# EAGLE design LocoShield (EAGLE 7.7.0)
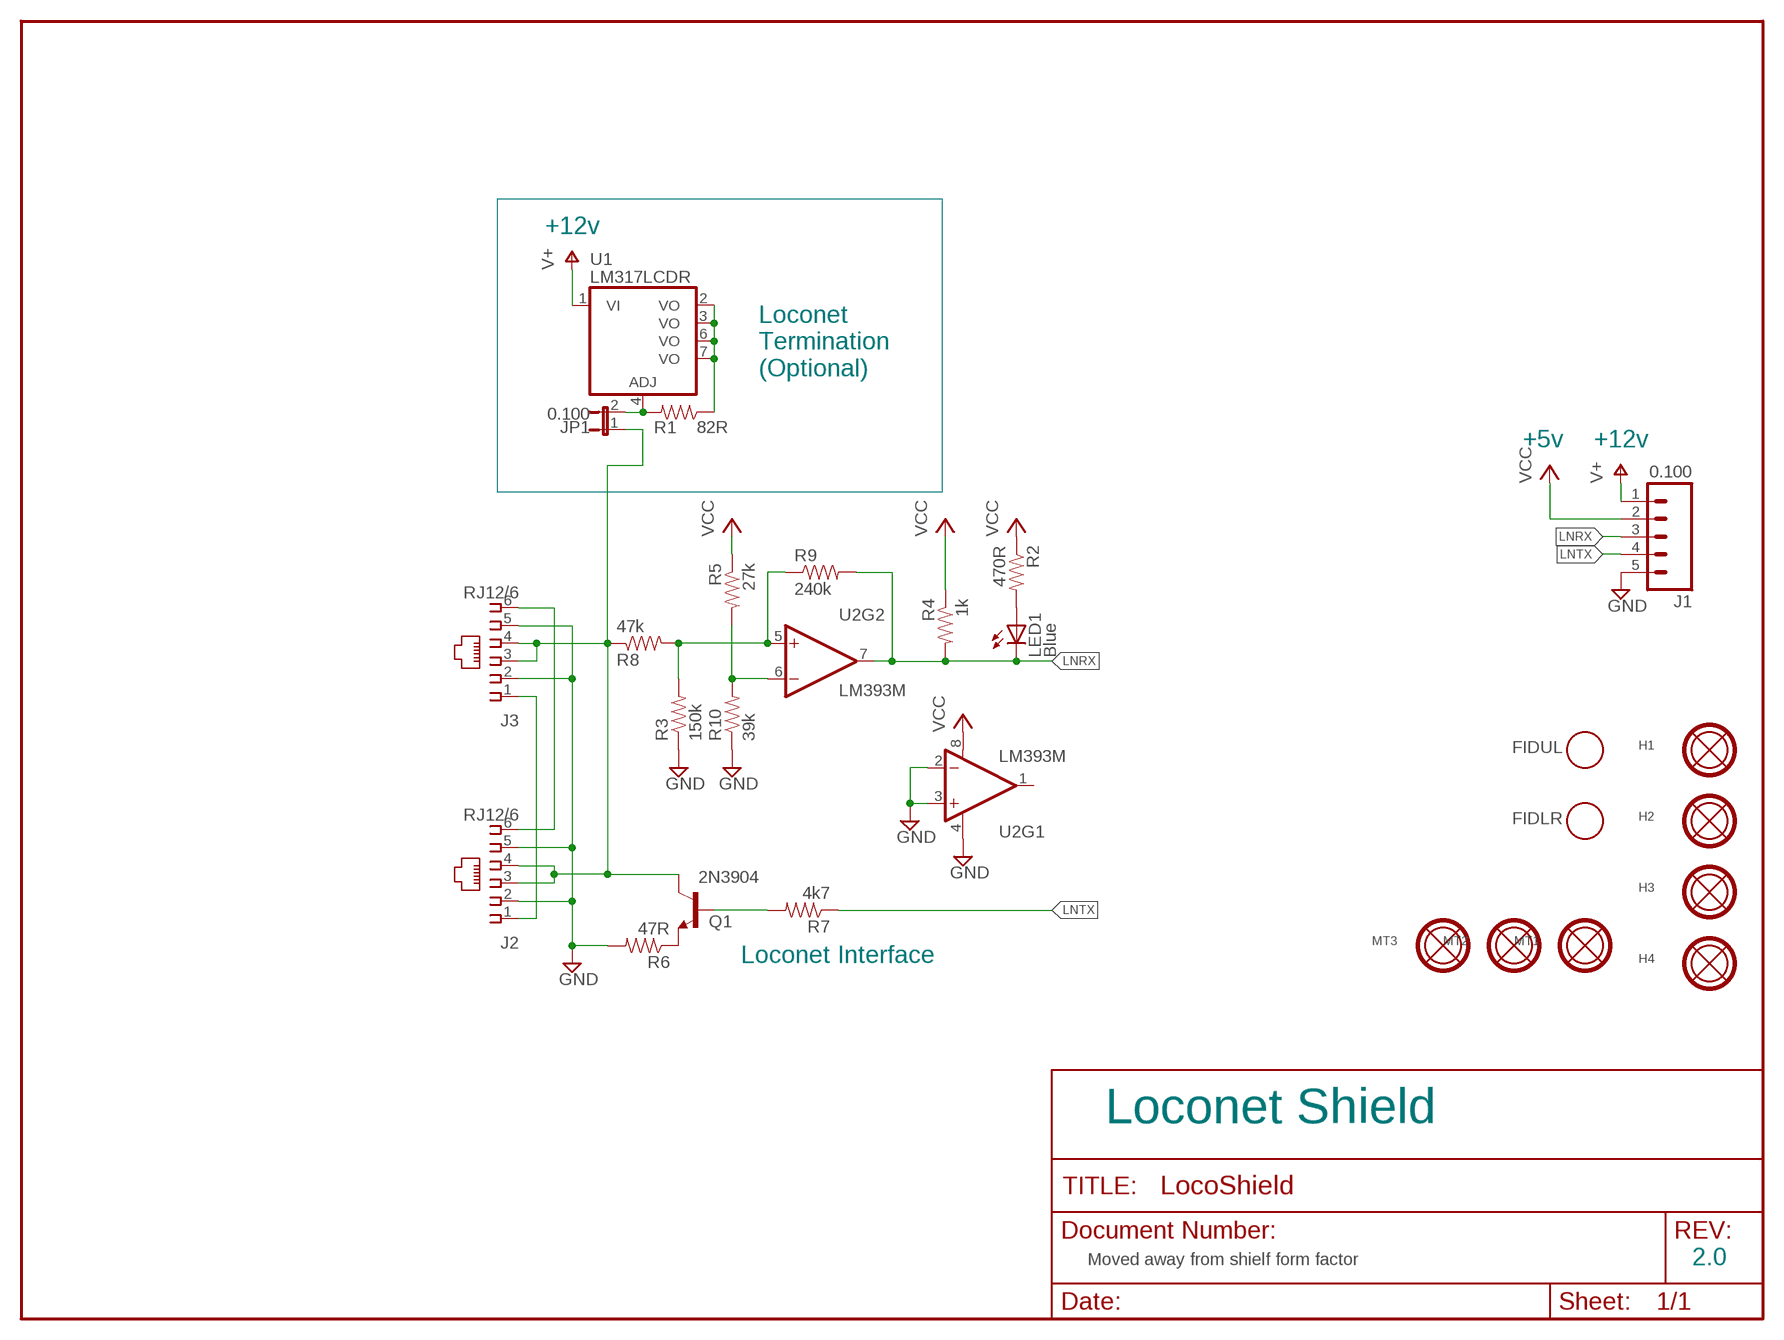
[diagram p0: schematic, sheet 1]

## Parts
FIDLR  FIDUCIAL  [FIDUCIAL_1MM]
FIDUL  FIDUCIAL  [FIDUCIAL_1MM]
H1  MOUNTINGHOLEL  [MOUNTINGHOLE-L]
H2  MOUNTINGHOLEL  [MOUNTINGHOLE-L]
H3  MOUNTINGHOLEL  [MOUNTINGHOLE-L]
H4  MOUNTINGHOLEL  [MOUNTINGHOLE-L]
J1  0.100  CONNECTOR-M05LOCK  [1X05_LOCK]
J2  RJ12/6  CONNECTOR-RJ25-6P6C  [RJ25-PANEL]
J3  RJ12/6  CONNECTOR-RJ25-6P6C  [RJ25-PANEL]
JP1  0.100  JUMPER-2PTH_LOCK  [1X02_LOCK]
LED1  Blue  LED0603-LED  [0603-LED]
MT1  tool  MOUNTINGHOLET  [MOUNTINGHOLE-TOOL]
MT2  tool  MOUNTINGHOLET  [MOUNTINGHOLE-TOOL]
MT3  tool  MOUNTINGHOLET  [MOUNTINGHOLE-TOOL]
Q1  2N3904  NPN-SOT23  [SOT23]
R1  82R  R0603-RES  [0603-RES]
R2  470R  R0603-RES  [0603-RES]
R3  150k  R0603-RES  [0603-RES]
R4  1k  R0603-RES  [0603-RES]
R5  27k  R0603-RES  [0603-RES]
R6  47R  R0603-RES  [0603-RES]
R7  4k7  R0603-RES  [0603-RES]
R8  47k  R0603-RES  [0603-RES]
R9  240k  R0603-RES  [0603-RES]
R10  39k  R0603-RES  [0603-RES]
U1  LM317LCDR  LM317LD  [SO08]
U2  LM393M  [SO08]

## Nets
DCCRAILSYNC-: J2.1 J3.1
GND [Power]: J1.5 J2.2 J2.5 J3.2 J3.5 R3.1 R6.2 R10.1 U2.2(-IN) U2.3(+IN) U2.4(V-)
LNRX: J1.3 LED1.C R4.2 R9.2 U2.7(OUT)
LNTX: J1.4 R7.1
LOCONET [Power]: J2.3 J2.4 J3.3 J3.4 JP1.1 Q1.3(C) R8.1
N$1: Q1.1(B) R7.2
N$2: R3.2 R8.2 R9.1 U2.5(+IN)
N$5: R5.2 R10.2 U2.6(-IN)
N$6: Q1.2(E) R6.1
N$15: LED1.A R2.2
N$20 [Power]: JP1.2 R1.2 U1.4(ADJ)
RAILSYNC+: J2.6 J3.6
V+ [Power]: J1.1 U1.1(VI)
VCC [Power]: J1.2 R2.1 R4.1 R5.1 U2.8(V+)
VOUT [Power]: R1.1 U1.2(VO) U1.3(VO) U1.6(VO) U1.7(VO)
Unconnected: U2.1(OUT)

## Notes on the sheet
- +12v
- Loconet
  Termination
  (Optional)
- +5v | +12v
- Loconet Interface
- Loconet Shield
- Moved away from shielf form factor | 2.0

## Library data of the parts
FIDLR FIDUL = SPCoast:FIDUCIAL: For use by pick and place machines to calibrate the vision/machine, 1mm By microbuilder.eu
H1-H4 MT1-MT3 = SPCoast:MOUNTINGHOLE: Mounting hole with top and bottom copper and stop rings
J1 = SPCoast:CONNECTOR-M05: Header 5 Standard 5-pin 0.1" header. Use with straight break away headers (SKU : PRT-00116), right angle break away headers (PRT-00553), swiss pins (PRT-00743), machine pins (PRT-00117), and female headers (PRT-00115). Molex polarized connector foot print use with SKU : PRT-08230 with associated crimp pins and housings.
J2 J3 = SPCoast:CONNECTOR-RJ25: AMP connector; AMP: 520250-3; OPL: none
JP1 = SPCoast:JUMPER-2: Jumper Basic 0.1" spaced jumper. Use with breakaway headers.
LED1 = SPCoast:LED*
Q1 = SPCoast:NPN: Transistor NPN BJT configuration in SOT23 package. MMBT2222 is the common NPN we use. Double check BCE configuration again layout.
R1-R10 = SPCoast:R*: Resistor Basic schematic elements and footprints for 0603, 1206, and PTH 1/10th watt (small) resistors.
U1 = SPCoast:LM317LD: LOW CURRENT 1.2 TO 37V ADJUSTABLE VOLTAGE REGULATOR Source: http://pdf.alldatasheet.com; JLC: C105219
U2 = SPCoast:LM393

## Net classes
0 default: width 0.254 mm
1 Power: width 0.406 mm, clearance 0.254 mm

## Board
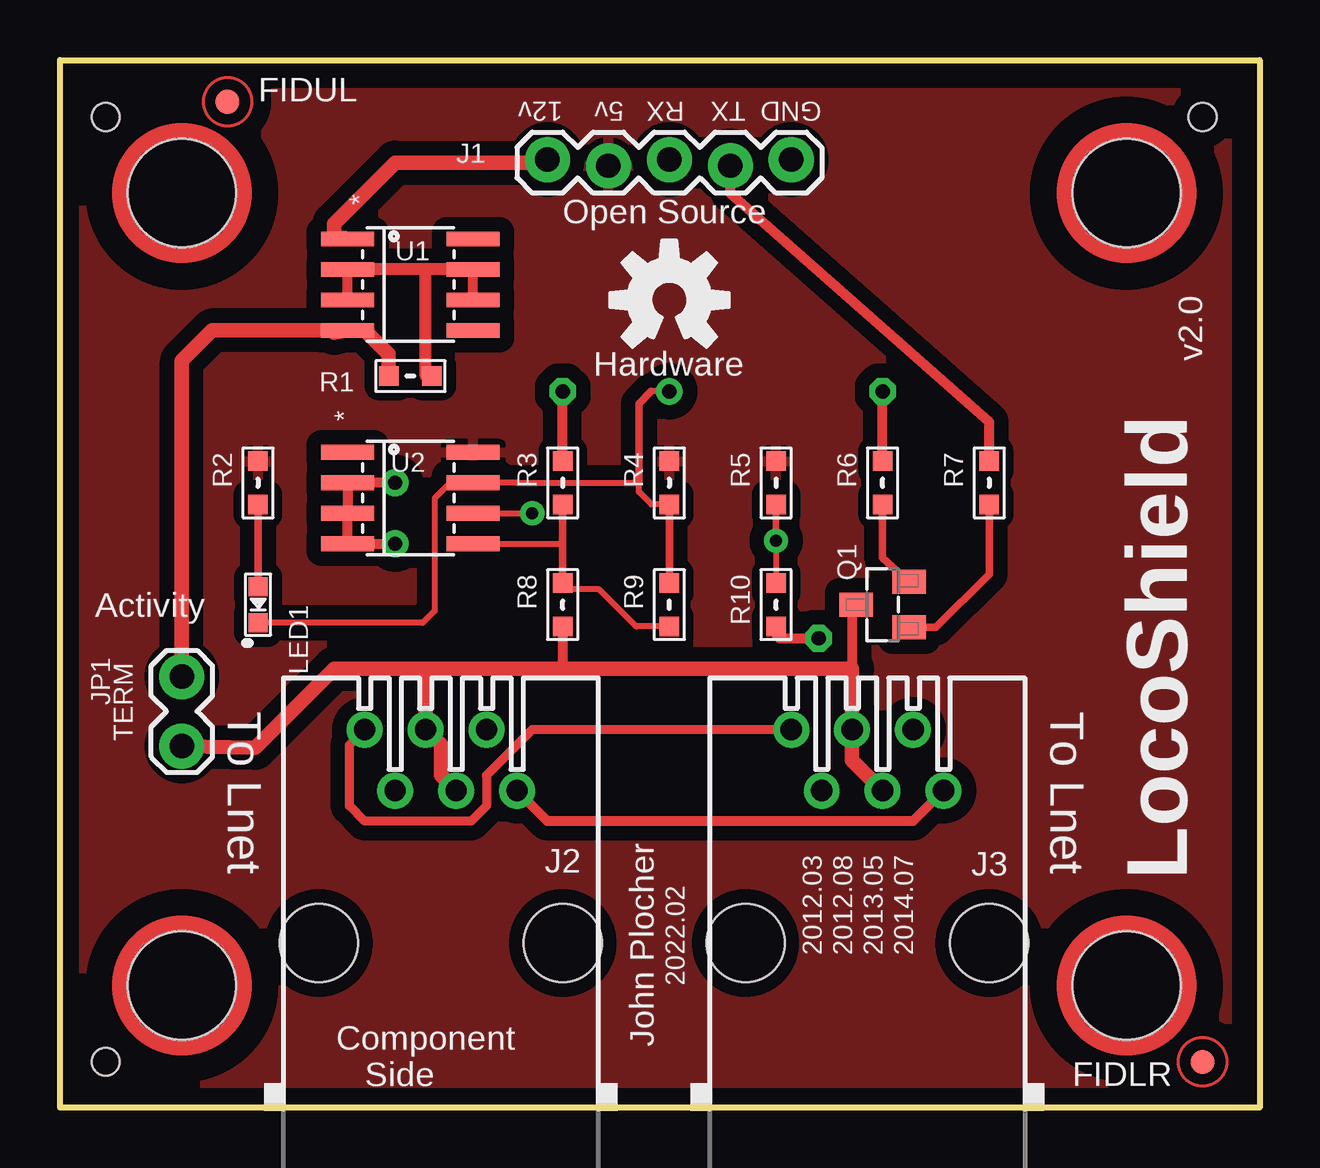
[diagram p1: board, top side]
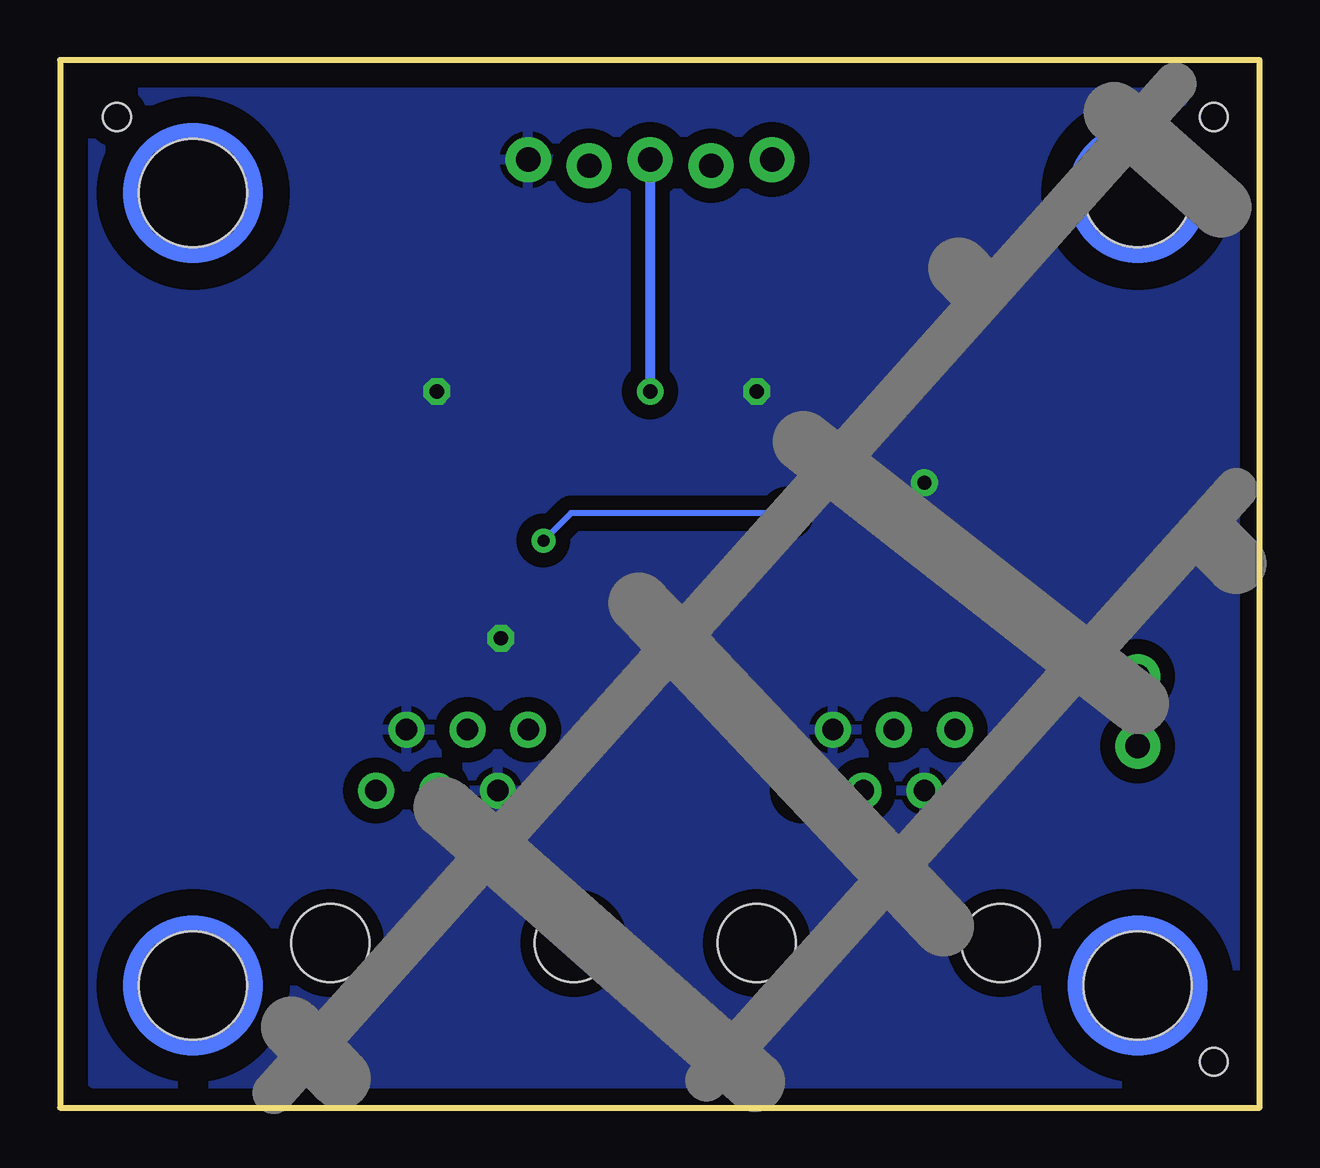
[diagram p2: board, bottom side, seen from below]

Size 50 x 43.65 mm. Coordinates in mm from the lower left corner, seen from the top.
Outline: 0,43.65 50,43.65 50,0 0,0 0,43.65
Copper layers (1*16): Top 0.035mm / dielectric 1.5mm / Bottom 0.035mm
Design rules "SparkFun *": minimum track width 8mil, minimum drill 0.5mm, track to track 10mil, track to pad 10mil, pad to pad 10mil, via to via 10mil, smd to smd 10mil, copper to edge 10mil, drill to drill 8mil, minimum pad ring 12mil, minimum via ring 10mil, stop-mask expansion 4mil, vias tented up to drill 25mil, thermal gap 10mil

### Footprints (pad centres in the part's own frame; a part is rotated, then mirrored left to right if it is on the bottom)
FIDUCIAL_1MM = smd 1 x 1: 1 0,0
MOUNTINGHOLE-L = hole 4.5: 0,0
1X05_LOCK = drill 1.016 pad 1.88: 1 0,0.127; 2 2.54,-0.127; 3 5.08,0.127; 4 7.62,-0.127; 5 10.16,0.127
RJ25-PANEL = drill 0.889: 1 -3.175,8.89; 2 -1.905,6.35; 3 -0.635,8.89; 4 0.635,6.35; 5 1.905,8.89; 6 3.175,6.35 | hole 3.251: -5.08,0; 5.08,0
1X02_LOCK = drill 1.016 pad 1.88: 1 -0.178,0; 2 2.718,0
0603-LED = smd 0.8 x 0.8: A 0.75,0; C -0.75,0
MOUNTINGHOLE-TOOL = hole 1.152: 0,0
SOT23 = smd 1.4 x 1: 1 1.1,-0.95; 2 1.1,0.95; 3 -1.1,0
0603-RES = smd 0.813 x 0.813: 1 -0.9,0; 2 0.9,0
SO08 = smd 0.61 x 2.21: 1 -1.905,-2.616; 2 -0.635,-2.616; 3 0.635,-2.616; 4 1.905,-2.616; 5 1.905,2.616; 6 0.635,2.616; 7 -0.635,2.616; 8 -1.905,2.616

### Placement (x,y rotation side)
FIDLR  47.62,1.91 180 top
FIDUL  6.99,41.91 0 top
H1  5.08,38.1 0 top
H2  44.45,38.1 0 top
H3  44.45,5.08 0 top
H4  5.08,5.08 0 top
J1  20.32,39.37 0 top
J2  15.88,6.86 0 top
J3  33.66,6.86 0 top
JP1  5.08,15.24 90 top
LED1  8.26,20.95 90 top
MT1  1.91,41.27 0 top
MT2  1.91,1.91 0 top
MT3  47.62,41.27 0 top
Q1  34.29,20.95 0 top
R1  14.61,30.48 180 top
R2  8.26,26.04 270 top
R3  20.95,26.04 270 top
R4  25.4,26.04 270 top
R5  29.84,26.04 270 top
R6  34.29,26.04 90 top
R7  38.73,26.04 270 top
R8  20.95,20.95 90 top
R9  25.4,20.95 90 top
R10  29.84,20.95 90 top
U1  14.61,34.29 270 top
U2  14.61,25.4 270 top
U$3  OSHW  [OSHW-LOGO-M]  25.4,33.66 0 top

### Tracks (layer width: path | path; a pad name or v marks a point on that pad's centre or on a via)
DCCRAILSYNC-
  Top 0.381: J2.1 12.06,15.11 12.06,12.57 12.7,11.94 17.14,11.94 17.78,12.57 17.78,13.84 19.68,15.75 J3.1
GND  (via drill 0.6)
  Top 0.406: R6.2 v34.29,29.84 | U2.2 U2.3 U2.4 | U2.4 12.06,23.5 | R3.1 v20.95,29.84 | R10.1 29.84,19.68 29.97,19.56 v31.62,19.56 | 11.43,26.04 12.06,26.04 v13.97,26.04 | U2.4 v13.97,23.5
  pour Bottom (isolate 0.61): 1.02,42.29 48.64,42.29 48.64,1.02 1.02,1.02
LNRX  (via drill 0.6)
  Top 0.254: v25.4,29.84 24.64,29.84 | R4.2 24.65,25.14 24.13,25.65 24.13,26.04 19.05,26.04 U2.7 16.26,26.04 15.62,25.4 15.62,20.7 15.11,20.19 LED1.C
  Top 0.305: R4.2 R9.2 | 24.64,29.84 24.13,29.34 24.13,26.04
  Bottom 0.406: J1.3 v25.4,29.84
LNTX
  Top 0.406: R7.1 38.73,28.57 27.94,38.1 J1.4
LOCONET
  Top 0.406: 33.02,20.95 Q1.3 33.02,20.79 33.02,18.29 | R8.1 20.95,18.29
  Top 0.61: J2.4 15.88,13.84 15.88,15.11 J2.3 15.24,18.29 | J3.4 33.02,14.48 J3.3 33.02,18.29 20.95,18.29 15.24,18.29 | JP1.1 8.13,14.99 11.43,18.29 15.24,18.29
N$1
  Top 0.305: 35.29,20.05 Q1.1 36.52,20 38.73,22.23 R7.2
N$2
  Top 0.254: R9.1 24.01,20.05 22.48,21.59 21.22,21.59 R8.2 | U2.5 20.95,23.5 20.95,22.86
  Top 0.305: U2.5 17.14,23.5 | R3.2 20.95,22.86 R8.2
N$5  (via drill 0.5)
  Top 0.254: U2.6 v19.68,24.77 | R10.2 29.84,24.77 v29.84,23.62 R5.2
  Top 0.305: U2.6 16.51,24.77
  Bottom 0.254: v19.68,24.77 28.7,24.77 v29.84,23.62
N$6
  Top 0.305: R6.1 34.29,22.91 Q1.2
N$15
  Top 0.305: R2.2 LED1.A
N$20
  Top 0.406: U1.4 11.43,32.38 U1.4
  Top 0.61: R1.2 13.71,31.38 12.7,32.38 U1.4 11.43,32.28 | JP1.2 5.08,31.11 6.35,32.38 11.43,32.38
RAILSYNC+
  Top 0.406: J2.6 20.32,11.94 35.56,11.94 J3.6
V+
  Top 0.61: 11.43,36.3 U1.1 11.43,36.3 | J1.1 20.32,39.37 13.97,39.37 11.43,36.83 11.43,36.3
VCC
  pour Top (isolate 0.61): 1.02,42.29 48.64,42.29 48.64,1.02 1.02,1.02
VOUT
  Top 0.406: U1.6 U1.7 | U1.3 U1.2
  Top 0.508: U1.7 15.24,34.92 | 15.24,34.92 U1.2 | R1.1 15.24,30.48 15.24,34.92

### Text on the board
tPlace: 12v | 5v | RX | TX | GND | * | Open Source | v2.0 | Hardware | * | Activity | To Lnet | To Lnet | TERM | LocoShield | 2012.03 | 2012.08 | 2013.05 | 2014.07 | 2022.02 | John Plocher | Component / Side
bDocu: Made in the PCR, Coast Division, NMRA | LocoShield | Solder Side | Go Bears! | RX pin goes to Timer ICP pin / Uno -> pin 8 / Leonardo -> pin 4 / Mega -> pin 48 (Timer 5) or 49 (T4) | SP Coast | Model Railroading is fun! | .com | www.
_tNames: J1 | U1 | R1 | R2 | U2 | R3 | R4 | R5 | R6 | R7 | Q1 | R8 | R9 | R10 | LED1 | JP1 | J2 | J3